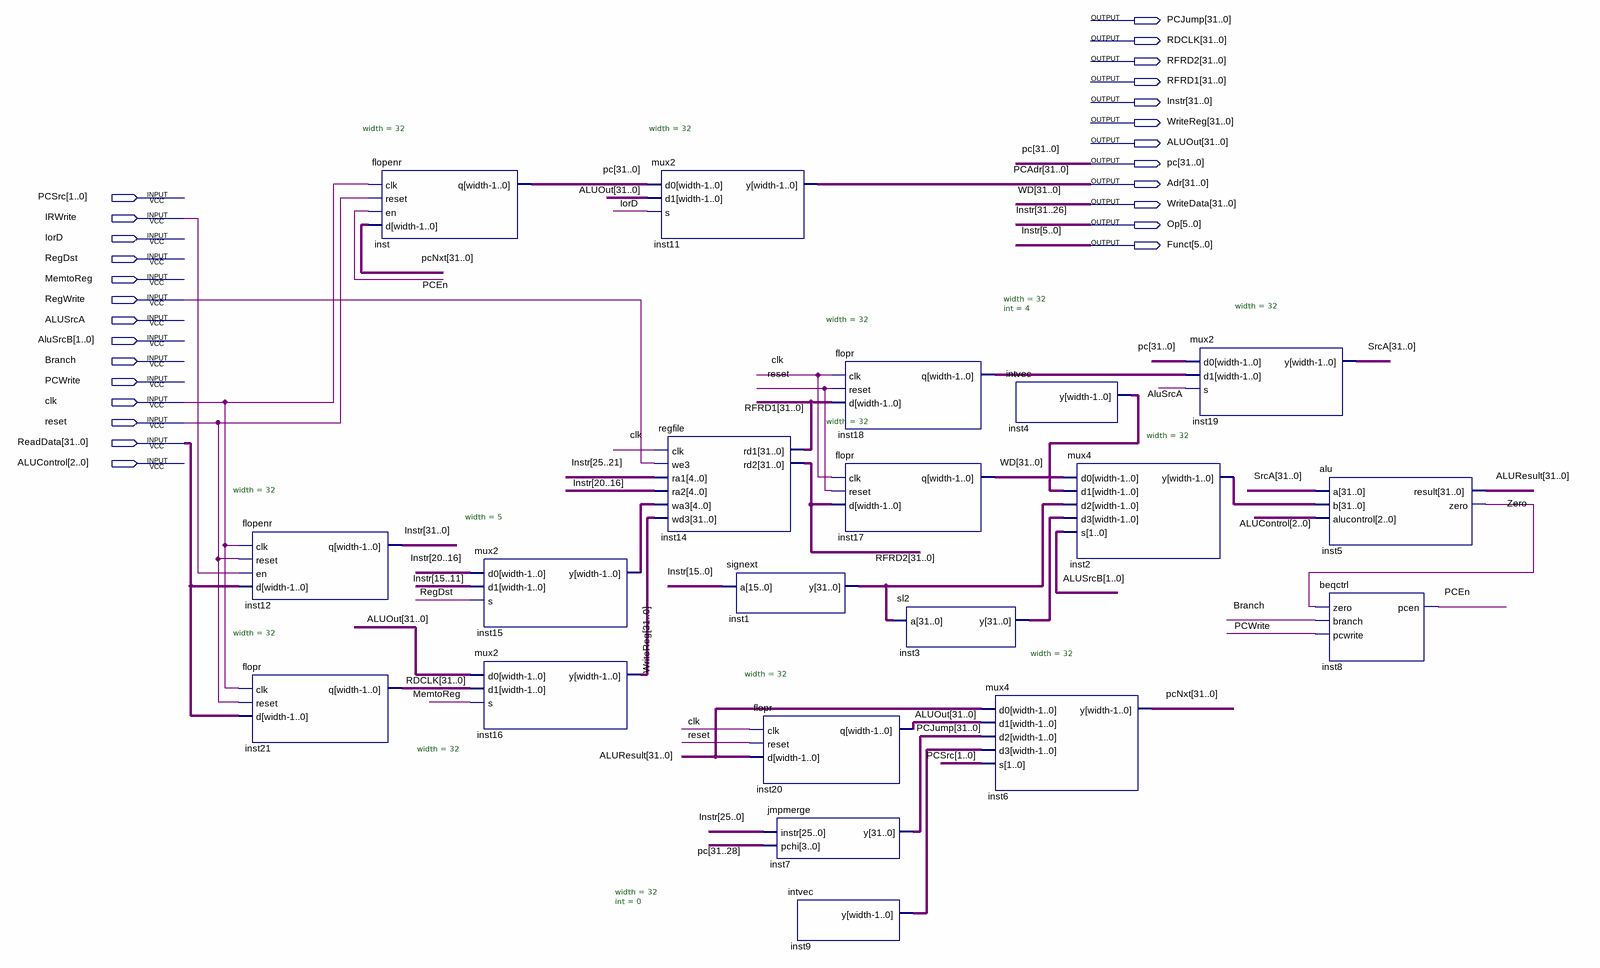
[diagram p0: schematic sheet]
// Quartus schematic datapath.bdf as structural Verilog: 20 symbols, 26 pins
module datapath (
  input  [1:0] PCSrc,
  input  IRWrite,
  input  IorD,
  input  RegDst,
  input  MemtoReg,
  input  RegWrite,
  input  ALUSrcA,
  input  [1:0] AluSrcB,
  input  Branch,
  input  PCWrite,
  input  clk,
  input  reset,
  input  [31:0] ReadData,
  input  [2:0] ALUControl,
  output [31:0] PCJump,
  output [31:0] RDCLK,
  output [31:0] RFRD2,
  output [31:0] RFRD1,
  output [31:0] Instr,
  output [31:0] WriteReg,
  output [31:0] ALUOut,
  output [31:0] pc,
  output [31:0] Adr,
  output [31:0] WriteData,
  output [5:0] Op,
  output [5:0] Funct
);

  wire PCEn, Zero;
  wire [4:0] inst15_y;
  wire [31:0] ALUResult, inst1_y, inst2_y, inst3_y, inst4_y, inst9_y, inst18_q, pcNxt, SrcA;

  flopenr #(.width(32)) inst12 (.clk(clk), .reset(reset), .en(IRWrite), .d(ReadData), .q({Instr[31:6], Funct}));
  flopr #(.width(32)) inst21 (.clk(clk), .reset(reset), .d(ReadData), .q(RDCLK));
  flopenr #(.width(32)) inst (.clk(clk), .reset(reset), .en(PCEn), .d(pcNxt), .q(pc));
  mux2 #(.width(5)) inst15 (.d0(Instr[20:16]), .d1(Instr[15:11]), .s(RegDst), .y(inst15_y));
  mux2 #(.width(32)) inst16 (.d0(ALUOut), .d1(RDCLK), .s(MemtoReg), .y(WriteReg));
  mux2 #(.width(32)) inst11 (.d0(pc), .d1(ALUOut), .s(IorD), .y(Adr));
  regfile inst14 (
    .clk(clk), .we3(RegWrite), .ra1(Instr[25:21]), .ra2(Instr[20:16]), .wa3(inst15_y), .wd3(WriteReg),
    .rd1(RFRD1), .rd2(RFRD2));
  signext inst1 (.a({Instr[15:6], Funct}), .y(inst1_y));
  flopr #(.width(32)) inst20 (.clk(clk), .reset(reset), .d(ALUResult), .q(ALUOut));
  jmpmerge inst7 (.instr({Instr[25:6], Funct}), .pchi(pc[31:28]), .y(PCJump));
  intvec #(.width(32), .\int (0)) inst9 (.y(inst9_y));
  flopr #(.width(32)) inst18 (.clk(clk), .reset(reset), .d(RFRD1), .q(inst18_q));
  flopr #(.width(32)) inst17 (.clk(clk), .reset(reset), .d(RFRD2), .q(WriteData));
  sl2 inst3 (.a(inst1_y), .y(inst3_y));
  intvec #(.width(32), .\int (4)) inst4 (.y(inst4_y));
  mux4 #(.width(32)) inst6 (.d0(ALUResult), .d1(ALUOut), .d2(PCJump), .d3(inst9_y), .s(PCSrc), .y(pcNxt));
  mux4 #(.width(32)) inst2 (.d0(WriteData), .d1(inst4_y), .d2(inst1_y), .d3(inst3_y), .s(AluSrcB), .y(inst2_y));
  mux2 #(.width(32)) inst19 (.d0(pc), .d1(inst18_q), .s(ALUSrcA), .y(SrcA));
  alu inst5 (.a(SrcA), .b(inst2_y), .alucontrol(ALUControl), .result(ALUResult), .zero(Zero));
  beqctrl inst8 (.zero(Zero), .branch(Branch), .pcwrite(PCWrite), .pcen(PCEn));

  assign Instr[5:0] = Funct;
  assign Op = Instr[31:26];

  // Other names for the same wires on the sheet: PCAdr[31:0] = Adr; WD[31:0] = WriteData
endmodule
